# EAGLE schematic example (EAGLE 8.0.1)
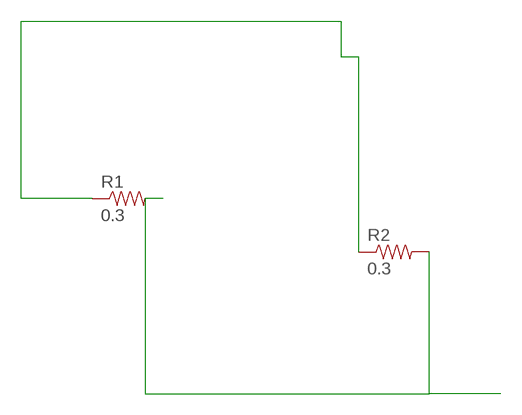
[diagram p0: schematic, sheet 1]

## Parts
R1  0.3  0.3OHM-1/8W-1%(0805)  [0805]
R2  0.3  0.3OHM-1/8W-1%(0805)  [0805]

## Nets
N$1: R1.1 R2.1
N$2: R1.2 R2.2

## Library data of the parts
R1 R2 = SparkFun-Resistors:0.3OHM-1/8W-1%(0805): RES-11622; PROD_ID: RES-11622